# EAGLE design p2005-06_squaredboard (EAGLE 4.13)
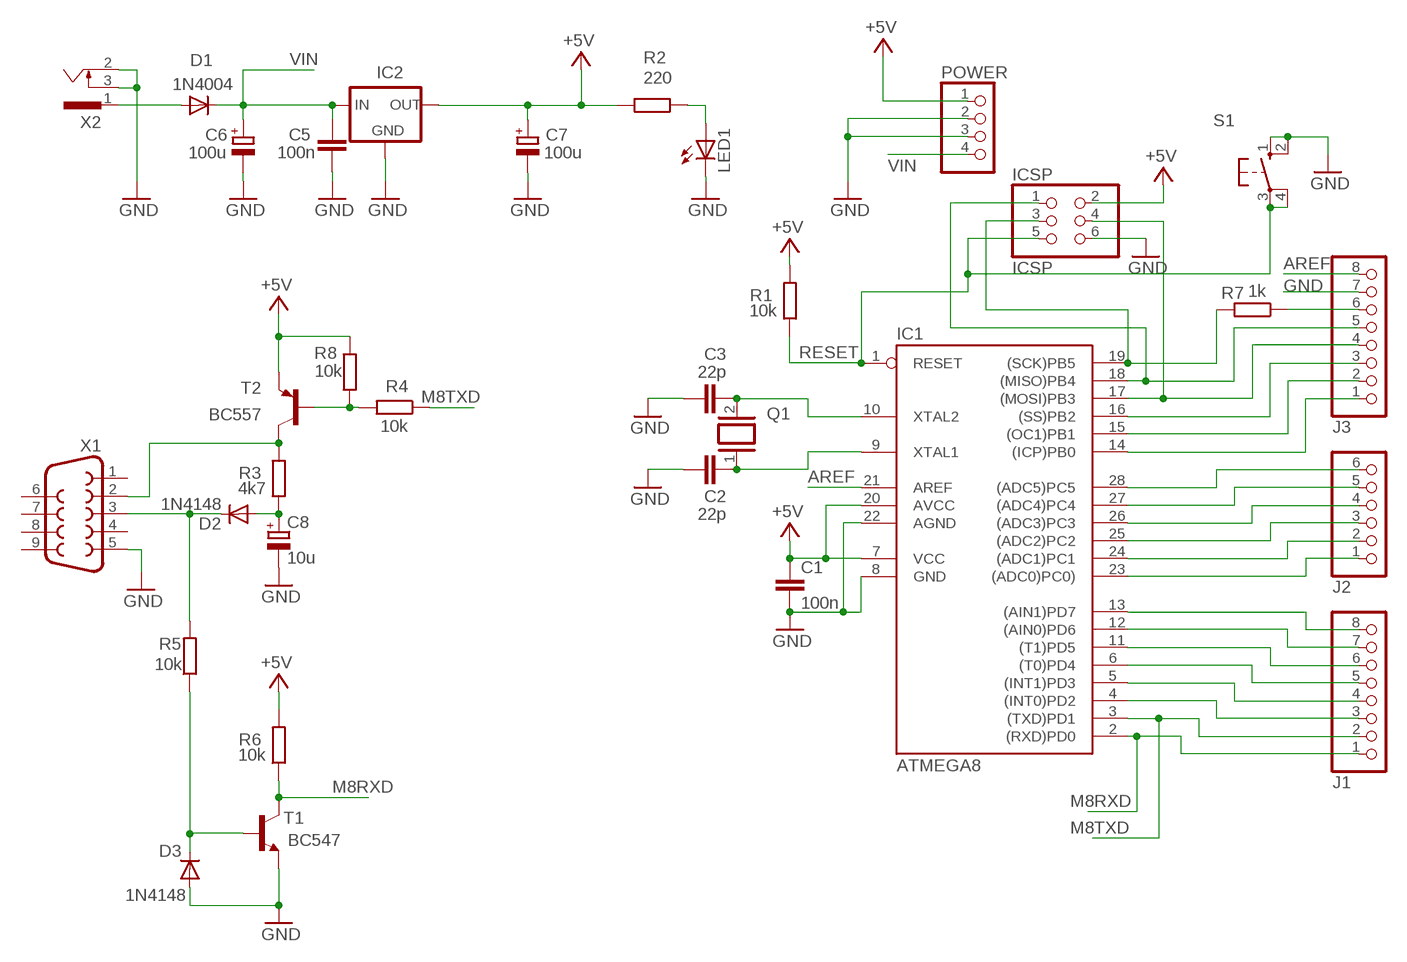
[diagram p0: schematic, sheet 1]

## Parts
C1  100n  C-EU050-025X075  [C050-025X075]
C2  22p  C-EU050-025X075  [C050-025X075]
C3  22p  C-EU050-025X075  [C050-025X075]
C5  100n  C-EU050-025X075  [C050-025X075]
C6  100u  CPOL-EUE3.5-8  [E3,5-8]
C7  100u  CPOL-EUE3.5-8  [E3,5-8]
C8  10u  CPOL-EUE5-6  [E5-6]
D1  1N4004  [DO41-10]
D2  1N4148  [DO35-10]
D3  1N4148  [DO35-10]
IC1  ATMEGA8  AT90S4433P  [DIL28-3]
IC2  78XXL  [78XXL]
ICSP  ICSP  PINHD-2X3  [2X03]
J1  PINHD-1X8  [1X08]
J2  PINHD-1X6  [1X06]
J3  PINHD-1X8  [1X08]
LED1  LED3MM  [LED3MM]
POWER  PINHD-1X4  [1X04]
Q1  XTAL/S  [QS]
R1  10k  R-EU_0207/10  [0207/10]
R2  220  R-EU_0207/10  [0207/10]
R3  4k7  R-EU_0207/10  [0207/10]
R4  10k  R-EU_0207/10  [0207/10]
R5  10k  R-EU_0207/10  [0207/10]
R6  10k  R-EU_0207/10  [0207/10]
R7  1k  R-EU_0207/10  [0207/10]
R8  10k  R-EU_0207/10  [0207/10]
S1  10-XX  [B3F-10XX]
T1  BC547  [TO92]
T2  BC557  BC557B-PNP-TO92-EBC  [TO92-EBC]
X1  F09H  [F09H]
X2  SCD-014A  [SCD-014-A]

## Nets
+5V [power]: C1.1 C7.+ IC1.7(VCC) IC1.20(AVCC) IC2.OUT ICSP.2 POWER.1 R1.2 R2.2 R6.2 R8.1 T2.E
AREF: IC1.21(AREF) J3.8
GND [power]: C1.2 C2.1 C3.1 C5.1 C6.- C7.- C8.- D3.A IC1.8(GND) IC1.22(AGND) IC2.GND ICSP.6 J3.7 LED1.K(C) POWER.2 POWER.3 S1.1(S) S1.2(S1) T1.1(E) X1.5 X2.2 X2.3
M8RXD: IC1.2((RXD)PD0) J1.1 R6.1 T1.3(C)
M8TXD: IC1.3((TXD)PD1) J1.2 R4.1
N$1: IC1.18((MISO)PB4) ICSP.1 J3.5
N$2: J3.6 R7.1
N$3: LED1.A R2.1
N$4: IC1.17((MOSI)PB3) ICSP.4 J3.4
N$5: IC1.14((ICP)PB0) J3.1
N$6: C2.2 IC1.9(XTAL1) Q1.1
N$7: C3.2 IC1.10(XTAL2) Q1.2
N$8 [power]: D1.A X2.1
N$9: R3.2 T2.C X1.2
N$10: IC1.4((INT0)PD2) J1.3
N$11: IC1.5((INT1)PD3) J1.4
N$12: IC1.6((T0)PD4) J1.5
N$13: IC1.11((T1)PD5) J1.6
N$14: IC1.12((AIN0)PD6) J1.7
N$15: IC1.13((AIN1)PD7) J1.8
N$16: IC1.23((ADC0)PC0)) J2.1
N$17: IC1.24((ADC1)PC1) J2.2
N$18: IC1.25((ADC2)PC2) J2.3
N$19: IC1.26((ADC3)PC3) J2.4
N$20: IC1.27((ADC4)PC4) J2.5
N$21: IC1.28((ADC5)PC5) J2.6
N$22: IC1.15((OC1)PB1) J3.2
N$23: IC1.16((SS)PB2) J3.3
N$24: C8.+ D2.A R3.1
N$25: D2.C R5.2 X1.3
N$27: R4.2 R8.2 T2.B
N$29: D3.C R5.1 T1.2(B)
RESET: IC1.1(RESET) ICSP.5 R1.1 S1.3(P) S1.4(P1)
SCK: IC1.19((SCK)PB5) ICSP.3 R7.2
VIN [power]: C5.2 C6.+ D1.C IC2.IN POWER.4
Unconnected: X1.1 X1.4 X1.6 X1.7 X1.8 X1.9

## Library data of the parts
C1-C3 C5 = rcl:C-EU: CAPACITOR, European symbol
C6-C8 = rcl:CPOL-EU: POLARIZED CAPACITOR, European symbol
D1 = diode:1N4004: DIODE general purpose rectifier, 1 A
D2 D3 = diode:1N4148: DIODE high speed (Philips)
IC1 = atmel:AT90S4433: MICROCONTROLLER 4 Kbytes FLASH 128 bytes SRAM 256 bytes EEPROM UART 6-channel 10 bit ADC
IC2 = v-reg:78XXL: VOLTAGE REGULATOR
ICSP = pinhead:PINHD-2X3: PIN HEADER
J1 J3 = pinhead:PINHD-1X8: PIN HEADER
J2 = pinhead:PINHD-1X6: PIN HEADER
LED1 = led:LED: LED OSRAM: - CHIPLED LG R971, LG N971, LY N971, LG Q971, LY Q971, LO R971, LY R971 LH N974, LH R974 LS Q976, LO Q976, LY Q976 LO Q996 - Hyper CHIPLED LW Q18S LB Q993, LB Q99A, LB R99A - SideLED LS A670, LO A670, LY A670, LG A670, LP A670 LB A673, LV A673, LT A673, LW A673 LH A674 LY A675 LS A676, LA A676, LO A676, LY A676, LW A676 LS A679, LY A679, LG A679 - Hyper Micro SIDELED® LS Y876, LA Y876, LO Y876, LY Y876 LT Y87S - SmartLED LW L88C, LW L88S LB L89C, LB L89S, LG L890 LS L89K, LO L89K, LY L89K LS L896, LA L896, LO L896, LY L896 - TOPLED LS T670, LO T670, LY T670, LG T670, LP T670 LSG T670, LSP T670, LSY T670, LOP T670, LYG T670 LG T671, LOG T671, LSG T671 LB T673, LV T673, LT T673, LW T673 LH T674 LS T676, LA T676, LO T676, LY T676, LB T676, LH T676, LSB T676, LW T676 LB T67C, LV T67C, LT T67C, LS T67K, LO T67K, LY T67K, LW E67C LS E67B, LA E67B, LO E67B, LY E67B, LB E67C, LV E67C, LT E67C LW T67C LS T679, LY T679, LG T679 LS T770, LO T770, LY T770, LG T770, LP T770 LB T773, LV T773, LT T773, LW T773 LH T774 LS E675, LA E675, LY E675, LS T675 LS T776, LA T776, LO T776, LY T776, LB T776 LHGB T686 LT T68C, LB T68C - Hyper Mini TOPLED® LB M676 - Mini TOPLED Santana® LG M470 LS M47K, LO M47K, LY M47K Source: http://www.osram.convergy.de/
POWER = pinhead:PINHD-1X4: PIN HEADER
Q1 = special:XTAL/S: CRYSTAL
R1-R8 = rcl:R-EU_: RESISTOR, European symbol
S1 = switch-omron:10-XX: OMRON SWITCH
T1 = transistor:BC547: NPN TRANSISTOR
T2 = transistor:*-PNP-: PNP Transistror
X1 = con-subd:F09: SUB-D
X2 = con-shiua-chyuan:SCD-014A: Power Jack 2.5mm

## Net classes
1 power: width 0.61 mm

## Board
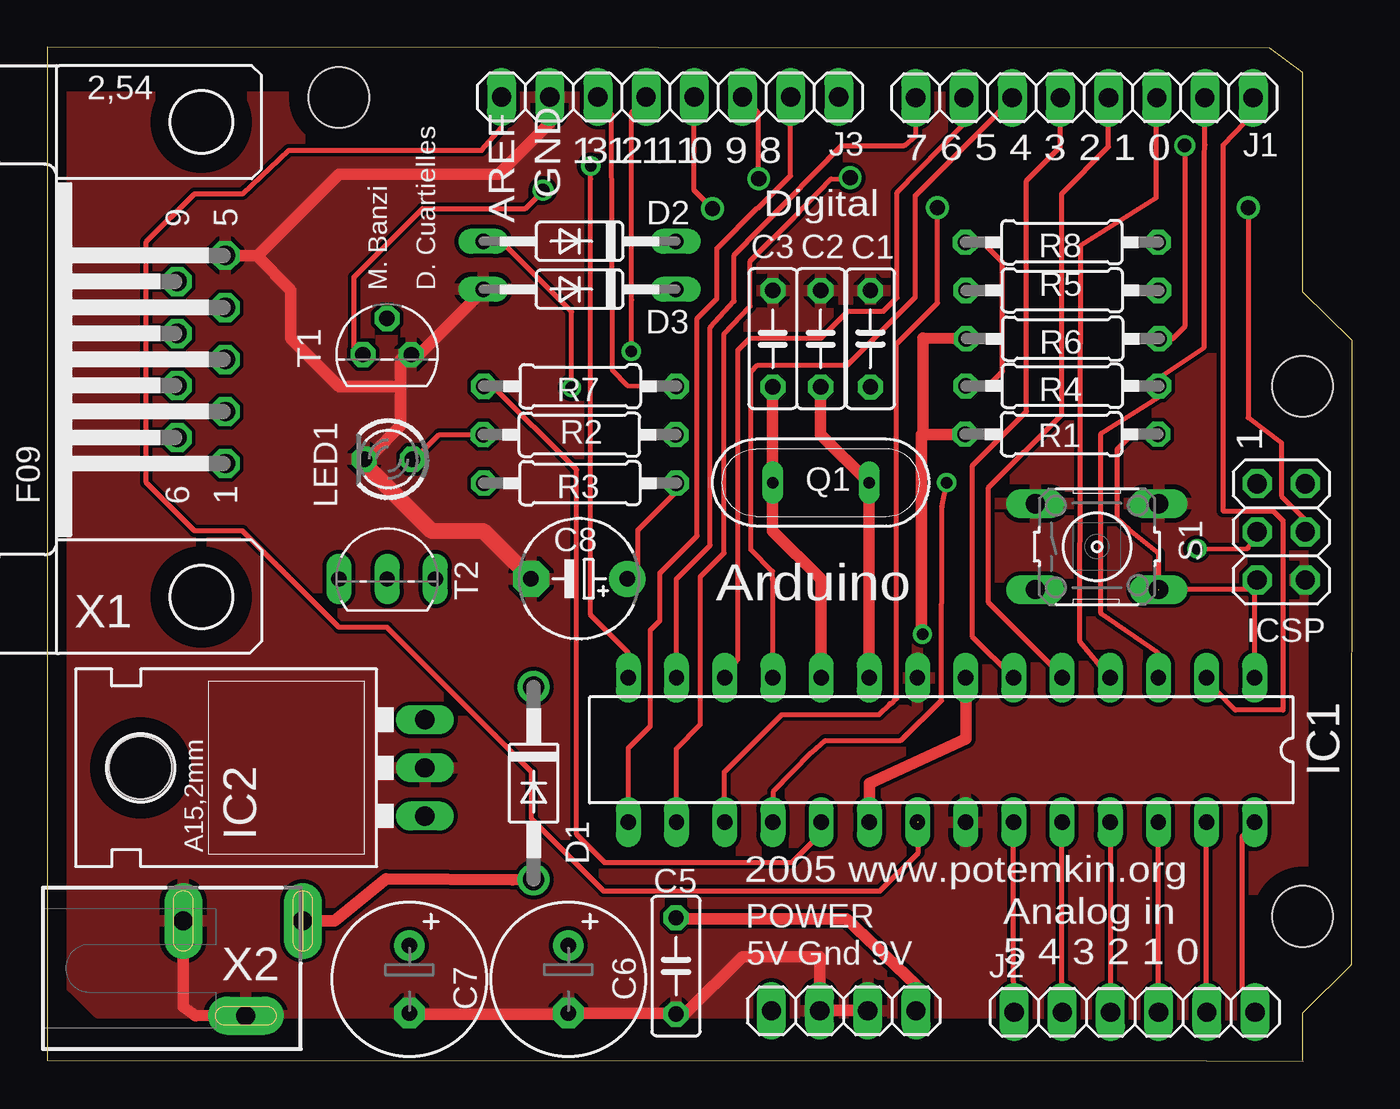
[diagram p1: board, top side]
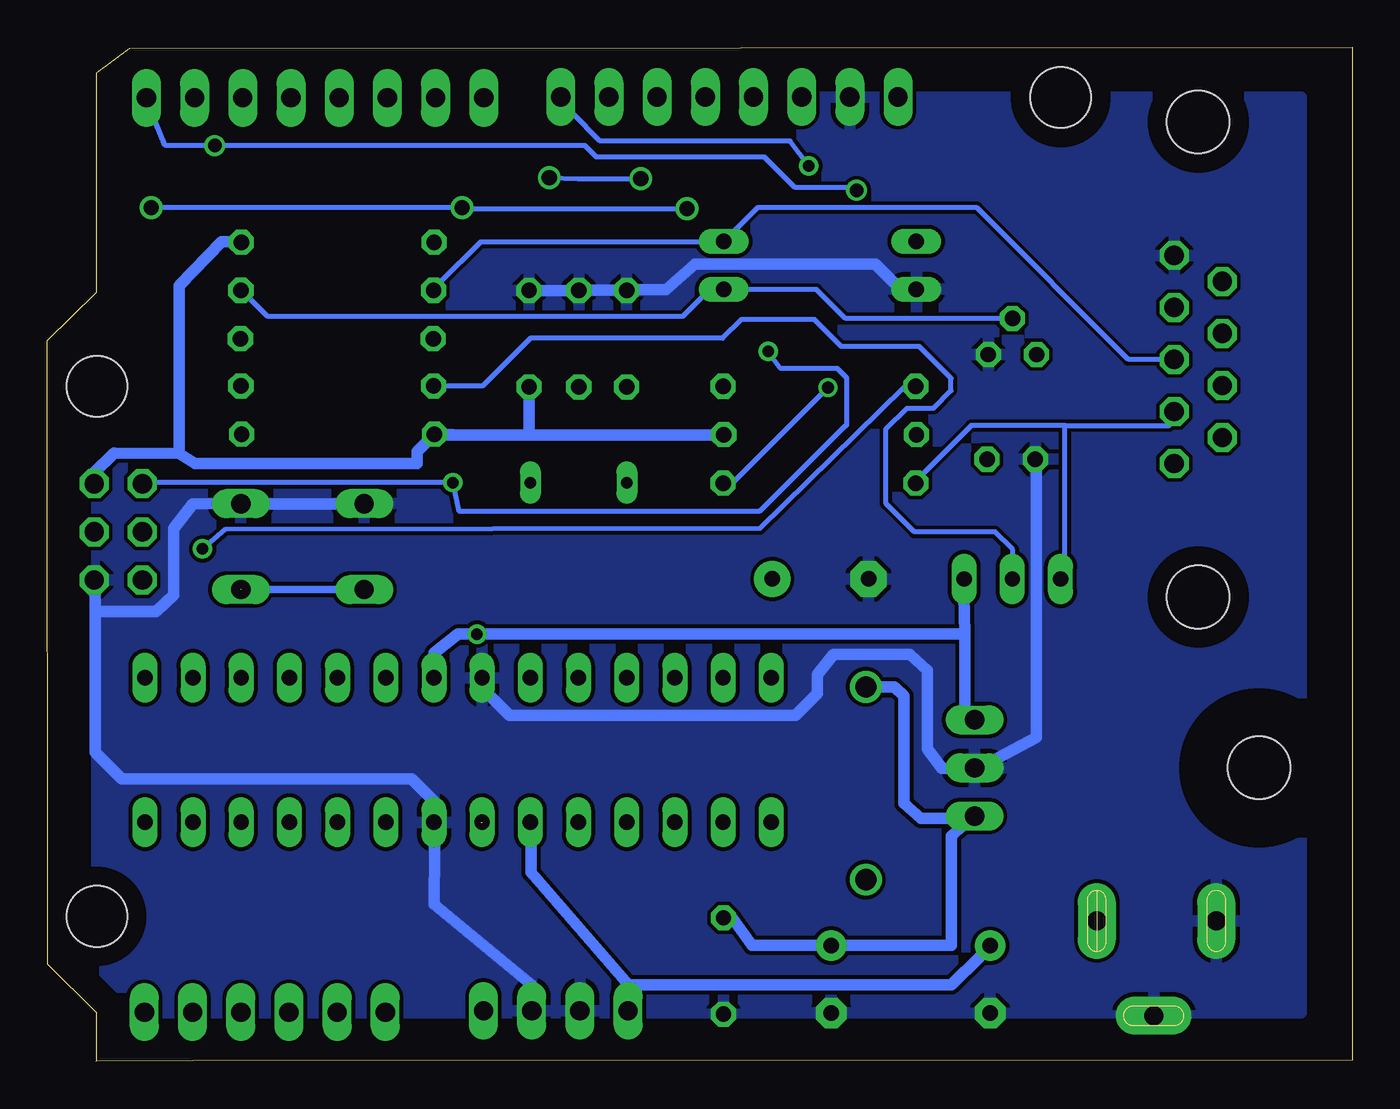
[diagram p2: board, bottom side, seen from below]

Size 68.77 x 53.44 mm. Coordinates in mm from the lower left corner, seen from the top.
Outline: 0,53.44 0,0.05 61.09,0.01 66.19,0 66.19,0.05 66.17,2.55 68.75,5.11 68.77,38 66.17,40.54 66.17,52.1 64.44,53.4 0,53.44
Copper layers (1*16): Top 0.035mm / dielectric 1.5mm / Bottom 0.035mm
Design rules "default": minimum track width 10mil, minimum drill 24mil, track to track 8mil, track to pad 8mil, pad to pad 8mil, via to via 8mil, smd to smd 8mil, copper to edge 40mil, drill to drill 8mil, minimum pad ring 10mil, minimum via ring 8mil, stop-mask expansion 4mil, vias tented up to drill 0mil, thermal gap 10mil
Holes 3.2 mm at 66.17,35.57 66.17,7.63 15.37,50.81

### Footprints (pad centres in the part's own frame; a part is rotated, then mirrored left to right if it is on the bottom)
C050-025X075 = drill 0.813 octagon: 1 -2.54,0; 2 2.54,0
E3,5-8 = drill 0.813 pad 1.6 round: + -1.778,0 | drill 0.813 pad 1.6 octagon: - 1.778,0
E5-6 = drill 0.813 pad 1.905 round: + -2.54,0 | drill 0.813 pad 1.905 octagon: - 2.54,0
DO41-10 = drill 1.118 round: A 5.08,0; C -5.08,0
DO35-10 = drill 0.813 long: A 5.08,0; C -5.08,0
DIL28-3 = drill 0.813 long: 1 -16.51,-3.81; 2 -13.97,-3.81; 3 -11.43,-3.81; 4 -8.89,-3.81; 5 -6.35,-3.81; 6 -3.81,-3.81; 7 -1.27,-3.81; 8 1.27,-3.81; 9 3.81,-3.81; 10 6.35,-3.81; 11 8.89,-3.81; 12 11.43,-3.81; 13 13.97,-3.81; 14 16.51,-3.81; 15 16.51,3.81; 16 13.97,3.81; 17 11.43,3.81; 18 8.89,3.81; 19 6.35,3.81; 20 3.81,3.81; 21 1.27,3.81; 22 -1.27,3.81; 23 -3.81,3.81; 24 -6.35,3.81; 25 -8.89,3.81; 26 -11.43,3.81; 27 -13.97,3.81; 28 -16.51,3.81
78XXL = drill 1.016 long: GND 0,-3.81; IN -2.54,-3.81; OUT 2.54,-3.81 | hole 3.302: 0,11.176
2X03 = drill 1.016 octagon: 1 -2.54,-1.27; 2 -2.54,1.27; 3 0,-1.27; 4 0,1.27; 5 2.54,-1.27; 6 2.54,1.27
1X08 = drill 1.016 long: 1 -8.89,0; 2 -6.35,0; 3 -3.81,0; 4 -1.27,0; 5 1.27,0; 6 3.81,0; 7 6.35,0; 8 8.89,0
1X06 = drill 1.016 long: 1 -6.35,0; 2 -3.81,0; 3 -1.27,0; 4 1.27,0; 5 3.81,0; 6 6.35,0
LED3MM = drill 0.813 octagon: A -1.27,0; K 1.27,0
1X04 = drill 1.016 long: 1 -3.81,0; 2 -1.27,0; 3 1.27,0; 4 3.81,0
QS = drill 0.61 long: 1 -2.54,0; 2 2.54,0
0207/10 = drill 0.813 octagon: 1 -5.08,0; 2 5.08,0
B3F-10XX = drill 1.016 long: 1 -3.251,2.261; 2 3.251,2.261; 3 -3.251,-2.261; 4 3.251,-2.261
TO92 = drill 0.813 octagon: 1 1.27,0; 2 0,1.905; 3 -1.27,0
TO92-EBC = drill 0.813 long: B 0,-1.27; C -2.54,-1.27; E 2.54,-1.27
F09H = drill 1.016 octagon: 1 -5.486,-1.27; 2 -2.743,-1.27; 3 0,-1.27; 4 2.743,-1.27; 5 5.486,-1.27; 6 -4.115,1.27; 7 -1.372,1.27; 8 1.372,1.27; 9 4.115,1.27 | hole 3.302: -12.522,0; 12.522,0
SCD-014-A = drill 1 pad 2 long: 1 -2.5,13.8; 2 -2.5,7.5; 3 2.5,10.8

### Placement (x,y rotation side)
C1  43.38,38.08 90 top
C2  40.76,38.09 270 top
C3  38.24,38.09 270 top
C5  33.14,5.01 90 top
C6  27.46,4.32 270 top
C7  19.08,4.31 270 top
C8  28.03,25.42 180 top
D1  25.63,14.65 270 top
D2  28.05,43.22 180 top
D3  28.05,40.69 180 top
IC1  47.13,16.4 180 top
IC2  16.09,15.46 90 top
ICSP  65.04,27.9 270 top
J1  54.67,50.79 180 top
J2  57.31,2.58 0 top
J3  32.83,50.83 180 top
LED1  17.97,31.73 180 top
POWER  41.97,2.65 0 top
Q1  40.77,30.5 180 top
R1  53.45,33.06 180 top
R2  28.04,33.03 0 top
R3  28.07,30.47 180 top
R4  53.5,35.59 180 top
R5  53.5,40.63 180 top
R6  53.52,38.09 180 top
R7  28.08,35.58 180 top
R8  53.47,43.17 180 top
S1  55.33,27.12 0 top
T1  17.9,37.25 0 top
T2  17.91,26.69 0 top
X1  8.11,36.99 90 top
X2  -0.34,4.89 270 top

### Tracks (layer width: path | path; a pad name or v marks a point on that pad's centre or on a via)
+5V  (via drill 0.61)  (1 unrouted)
  Top 0.61: IC1.7 48.41,19.01 48.41,16.99 43.33,14.65 43.33,12.73 43.31,12.71 43.32,12.7 IC1.20 | R6.2 46.16,38.11 46.16,33.01 48.39,33.03 46.08,33.03 46.08,22.51 v46.13,22.51
  Bottom 0.61: 43.38,33.01 46.33,33.01 | 46.33,33.01 48.13,33.01 | 43.38,33.01 33.63,33.01 R2.2 | 43.38,33.01 43.38,35.01 C1.1 | 61.84,32.04 61.84,40.88 59.58,43.21 59.13,43.21 R8.1 | 61.84,32.04 65.26,32.06 66.33,31.01 ICSP.2 | 61.84,32.04 60.98,31.51 49.27,31.51 49.27,32.15 48.39,33.03 R1.2 46.33,33.01 | 20.4,22.51 20.4,18.56 IC2.OUT | 20.4,22.51 20.45,24.56 T2.E | 38.13,4.01 43.28,9.95 43.28,12.68 43.31,12.71 43.32,12.7 IC1.20 | 38.13,4.01 21.13,4.01 19.63,5.51 C7.+ | 38.13,4.01 POWER.1 | 20.4,22.51 v46.13,22.51 47.13,22.51 48.38,21.51 IC1.7
AREF  (1 unrouted)
  Top 0.254: J3.8 23.93,49.22 22.89,48.02 12.73,48.02 10.29,45.73 7.75,45.73 5.21,43.19 5.21,30.49 7.75,27.95 10.29,27.95 15.37,22.87 17.91,22.87 25.53,15.25 25.53,12.76 29.31,8.98 43.89,8.98 45.9,10.98 45.9,12.58 45.91,12.59
GND
  Top 0.61: 18.63,35.6 18.63,33.51 17.13,32.01 LED1.K | 18.63,35.6 18.63,37.01 T1.1 19.59,37.25 22.99,40.65 22.97,40.67 D3.A | X2.3 7.76,2.43 7.81,2.4 7.15,2.87 X2.2 | C7.- 19.68,2.48 27.18,2.48 C6.- 28.13,2.51 32.63,2.51 C5.1 33.63,2.51 36.63,5.51 40.73,5.51 40.73,4.01 POWER.2 41.18,2.69 42.68,2.69 POWER.3 | X1.5 11,42.48 11.05,42.43 | 11.05,42.43 12.83,40.65 12.83,38.11 15.37,35.57 18.6,35.57 18.62,35.6 18.63,35.6 | J3.7 26.47,49.44 23.78,46.75 15.37,46.75 11.05,42.43
  Top 0.813: C8.- 25.49,25.45 22.99,27.95 20.25,27.95 16.47,31.73 | 16.47,31.73 16.46,31.74 | LED1.K 16.47,31.73
  Bottom 0.61: D3.A 24.13,41.01 25.13,42.01 34.63,42.01 36.16,40.66 37.66,40.66 C3.1 38.68,40.64 40.18,40.64 C2.1 43.29,40.63 43.31,40.65 43.34,40.62 C1.2 | S1.1 53.21,29.36 57.21,29.36 S1.2 61.13,29.37 62.12,28.07 62.12,24.57 63.04,23.71 65.04,23.71 66.24,23.72 ICSP.6 66.28,25.42 66.3,25.46 66.25,25.41 66.25,16.27 64.85,14.87 49.58,14.87 48.4,13.69 IC1.22 48.36,11.1 48.38,8.26 43.25,4.01 POWER.3 | LED1.K 16.63,31.51 16.63,17.08 18.63,16.01 IC2.GND 19.83,15.46 | IC1.8 45.86,19.68 44.4,18.22 29.34,18.22 28.17,19.39 28.17,20.38 27.33,21.45 23.29,21.45 22.38,20.58 22.38,16.47 21.62,15.43 19.87,15.43 19.83,15.46 | 19.83,15.46 19.79,15.5
  pour Top: 0.13,50.81 61.09,50.81 63.63,48.27 63.63,40.65 66.17,38.11 66.17,5.09 64.47,2.43 46.13,2.55 2.67,2.55 0.13,5.09
  pour Bottom: 2.67,50.81 61.09,50.81 63.68,48.22 63.66,40.6 66.17,38.09 66.17,5.09 63.63,2.55 2.67,2.55
M8RXD  (via drill 0.7)
  Top 0.254: IC1.2 61.63,19.51 62.63,18.51 65.13,18.51 65.13,28.51 64.63,29.01 61.97,29.01 61.97,48.3 63.13,49.51 J1.1 | R6.1 59.31,38.09 59.95,38.72 v59.95,48.27 | v26.11,45.91 26.11,45.86 25.2,44.94 19.76,44.94 16.16,41.34 16.16,37.65 16.63,37.18 | 16.63,37.18 16.66,37.15 | T1.3 16.63,37.18
  Bottom 0.254: v26.11,45.91 26.27,46.06 29.36,46.06 30.97,47.66 39.83,47.66 40.44,48.27 v59.95,48.27 62.56,48.27 63.56,50.71 J1.1
M8TXD
  Top 0.254: IC1.3 58.55,21.51 55.54,23.59 55.54,33.09 58.58,35.01 R4.1 58.61,36.04 60.98,37.62 60.98,47.75 61.01,48.29 J1.2
N$1  (via drill 0.61)
  Top 0.254: v47.4,30.5 47.16,29.21 47.13,19.01 44.98,16.91 40.99,16.9 40.27,16.27 38.27,14.22 IC1.18 | v30.78,37.42 30.8,40.12 30.8,49.99 J3.5
  Bottom 0.254: ICSP.1 63.13,30.51 50.13,30.51 v47.4,30.5 47.1,29.01 31.2,29.01 26.7,33.51 26.63,33.51 26.63,36.01 27.13,36.51 30.13,36.51 v30.78,37.42
N$2
  Top 0.254: R7.1 30.59,35.6 29.79,36.43 29.74,49.92 J3.6
N$3
  Top 0.254: LED1.A 19.26,31.73 19.31,31.68 20.65,33.03 R2.1
N$4  (via drill 0.8)
  Top 0.254: J3.4 34.1,45.9 v35.05,44.94 | v46.92,44.99 46.92,39.96 44.76,37.81 44.76,19.11 44.48,18.83 44.4,18.83 43.84,18.27 38.71,18.27 35.69,15.25 35.69,12.71 35.7,12.7 IC1.17 | ICSP.4 66.31,28.55 65.05,29.8 65.05,32.6 63.3,33.92 v63.3,44.99
  Bottom 0.254: v35.05,44.94 46.87,44.94 v46.92,44.99 | v46.92,44.99 46.84,44.99 | v46.92,44.99 v63.3,44.99
N$5  (via drill 0.61)
  Top 0.254: v28.64,47.19 28.63,46.51 28.63,23.51 30.63,21.51 IC1.14
  Bottom 0.254: v28.64,47.19 29.63,48.51 39.63,48.51 41.13,50.01 J3.1
N$6
  Top 0.61: IC1.9 43.31,21.46 43.31,29.46 Q1.1 40.76,33.04 C2.2
N$7
  Top 0.61: C3.2 38.23,35.01 38.23,31.51 Q1.2 38.23,27.95 40.77,25.41 40.77,20.33 40.78,20.32 IC1.10
N$8
  Top 0.61: X2.1 15.13,7.39 17.86,9.61 24.51,9.56 24.91,9.57 D1.A
N$9
  Bottom 0.254: 15.13,33.51 15.13,26.51 T2.C | 15.13,33.51 9.63,33.51 X1.2 | R3.2 22.99,30.55 23.02,30.57 20.07,33.51 15.13,33.51
N$10
  Top 0.254: IC1.4 54.43,22.12 54.48,43.01 58.45,45.51 58.45,49.51 J1.3
N$11
  Top 0.254: J1.4 55.94,48.2 53.47,45.73 53.47,34.1 49.61,30.24 49.61,24.19 53.48,20.32 IC1.5
N$12
  Top 0.254: J1.5 53.4,48.2 51.62,46.42 51.62,34.25 48.77,31.4 48.77,22.36 50.94,20.19 | 50.94,20.19 51.03,20.1 | IC1.6 50.94,20.19
N$13
  Top 0.254: IC1.11 38.24,25.4 | 38.23,25.41 38.23,25.82 37.09,26.96 37.09,36.33 37.44,36.69 42.17,36.69 45.75,40.27 45.75,45.63 50.91,50.79
  Top 0.305: 38.24,25.4 38.23,25.41 | 50.93,50.81 50.91,50.79 J1.6
N$14
  Top 0.254: J1.7 48.32,49.39 44.78,45.78 44.78,40.24 44.07,39.53 42.19,39.53 40.77,38.11 37.04,38.11 36.4,37.48 36.4,21.17 35.69,20.33 | IC1.12 35.7,20.32
  Top 0.305: 35.7,20.32 35.69,20.33
N$15
  Top 0.254: J1.8 45.78,48.78 45.16,48.27 41.86,48.27 36.2,42.48 36.2,40.07 34.93,38.67 34.93,27.19 33.15,25.41 33.15,20.33 33.16,20.32 IC1.13
N$16
  Top 0.254: IC1.23 50.93,11.69 50.93,4.19 J2.1
N$17
  Top 0.254: IC1.24 53.48,11.61 53.48,4.11 J2.2
N$18
  Top 0.254: IC1.25 56.05,11.56 56.05,4.06 J2.3
N$19
  Top 0.254: IC1.26 58.55,11.59 58.55,4.09 J2.4
N$20
  Top 0.254: IC1.27 61.08,11.51 61.08,4.01 J2.5
N$21
  Top 0.254: IC1.28 62.98,11.84 62.98,3.84 J2.6
N$22
  Top 0.254: IC1.15 30.62,16.51 31.78,17.66 31.78,22.72 32.29,23.23 32.29,25.74 34.24,27.7 34.24,39.15 35.28,40.19 35.28,42.83 37.44,44.99 37.49,44.99 39.17,46.67 39.17,50.94 | 39.17,50.94 39.18,50.93 J3.2 | 39.17,50.94 39.12,50.99
N$23  (via drill 0.8)
  Top 0.254: IC1.16 33.16,12.7 33.15,12.71 33.15,16.47 34.42,17.74 34.42,25.54 35.66,26.78 35.66,38.34 37.04,39.79 37.04,42.17 39.35,44.46 41.33,46.52 42.32,46.49 v42.32,46.57 | J3.3 37.49,49.97 v37.49,46.52
  Bottom 0.254: v42.32,46.57 40.82,46.52 v37.49,46.52
N$24  (via drill 0.61)
  Top 0.254: R3.1 33.13,30.01 31.13,28.01 31.13,26.01 C8.+ | v27.63,35.51 27.63,39.51 24.13,43.01 D2.A
  Bottom 0.254: v27.63,35.51 32.63,30.51 R3.1
N$25
  Bottom 0.254: R5.2 48.13,41.01 45.95,43.19 33.95,43.19 D2.C | X1.3 11.79,36.99 19.79,44.99 31.35,44.99 D2.C | D2.C 33.15,43.19
N$27
  Top 0.254: R8.2 49.3,43.17 50.35,42.12 50.35,36.36 49.51,35.52 48.44,35.52 48.41,35.55 R4.2
  Bottom 0.254: R4.2 45.83,35.59 43.31,38.11 33.18,38.11 32.19,39.1 28.35,39.1 26.93,37.68 22.81,37.68 21.14,36 21.14,35.34 22.05,34.43 23.47,34.43 24.56,33.34 24.56,29.4 23.07,27.9 18.82,27.9 17.88,26.96 17.88,25.56 17.78,25.46 17.83,25.42 T2.B
N$29
  Bottom 0.254: T1.2 26.7,39.15 28.22,40.68 33.12,40.68 33.13,40.67 | 33.13,40.67 33.15,40.65 | 33.13,40.67 D3.C 33.85,40.69 35.28,39.25 57.15,39.25 58.55,40.65 R5.1
RESET  (1 unrouted)
  Top 0.254: IC1.1 63.66,21.23 63.66,24.73 ICSP.5 63.66,24.88 62.22,24.88 S1.4 58.58,25.51 58.58,26.77 57.03,28.01 56.39,28.59 56.39,32.26 57.18,33.07 R1.1
  Bottom 0.406: S1.3 58.55,24.86
SCK  (via drill 0.61)
  Top 0.254: v60.6,27.01 63.24,27.03 63.28,27.03 ICSP.3 | IC1.19 40.78,12.01 39.25,10.48 29.36,10.48 27.89,11.95 27.89,31.18 23.35,35.72 23.2,35.58 R7.2
  Bottom 0.254: v60.6,27.01 59.39,28.04 31.21,28.09 23.63,35.51 R7.2
VIN
  Top 0.61: POWER.4 45.78,4.01 42.13,7.51 33.63,7.51 C5.2
  Bottom 0.61: C5.2 32.63,7.51 31.63,6.1 28.13,6.1 C6.+ 27.13,6.1 21.13,6.1 21.13,11.88 IC2.IN 19.9,12.96 | D1.C 24.12,19.73 23.62,19.26 23.62,13.6 22.74,12.79 20.07,12.79 19.9,12.96 | 19.9,12.96 19.79,13.07

### Text on the board
tNames: 1 1 1 1 | 3 2 1 0 9 8 | 7 6 5 4 3 2 1 0 | GND | Digital | AREF | M. Banzi | D. Cuartielles | 1 | Arduino | 2005 www.potemkin.org | Analog in | 5V Gnd 9V | 5 4 3 2 1 0